# EasyEDA Pro project LisaFPGA Rev 2 EasyEDA Project.epro, board LisaFPGA PCB
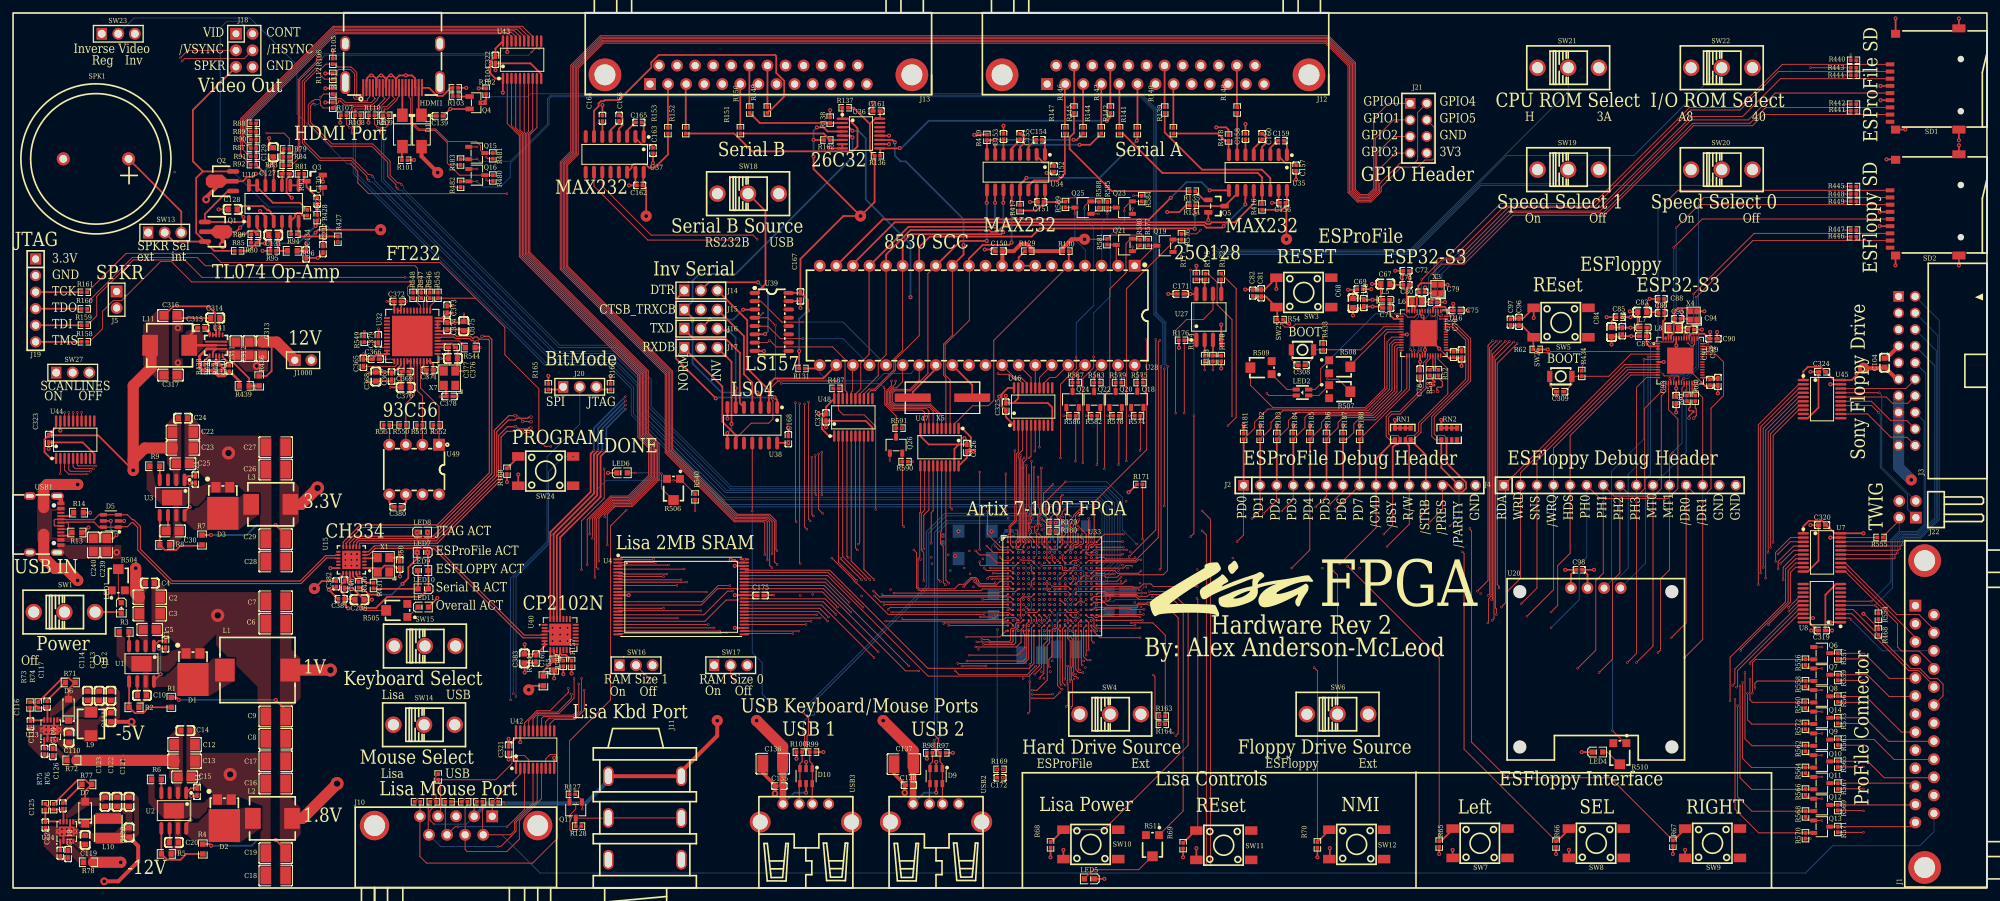
[diagram p11: board, top side]
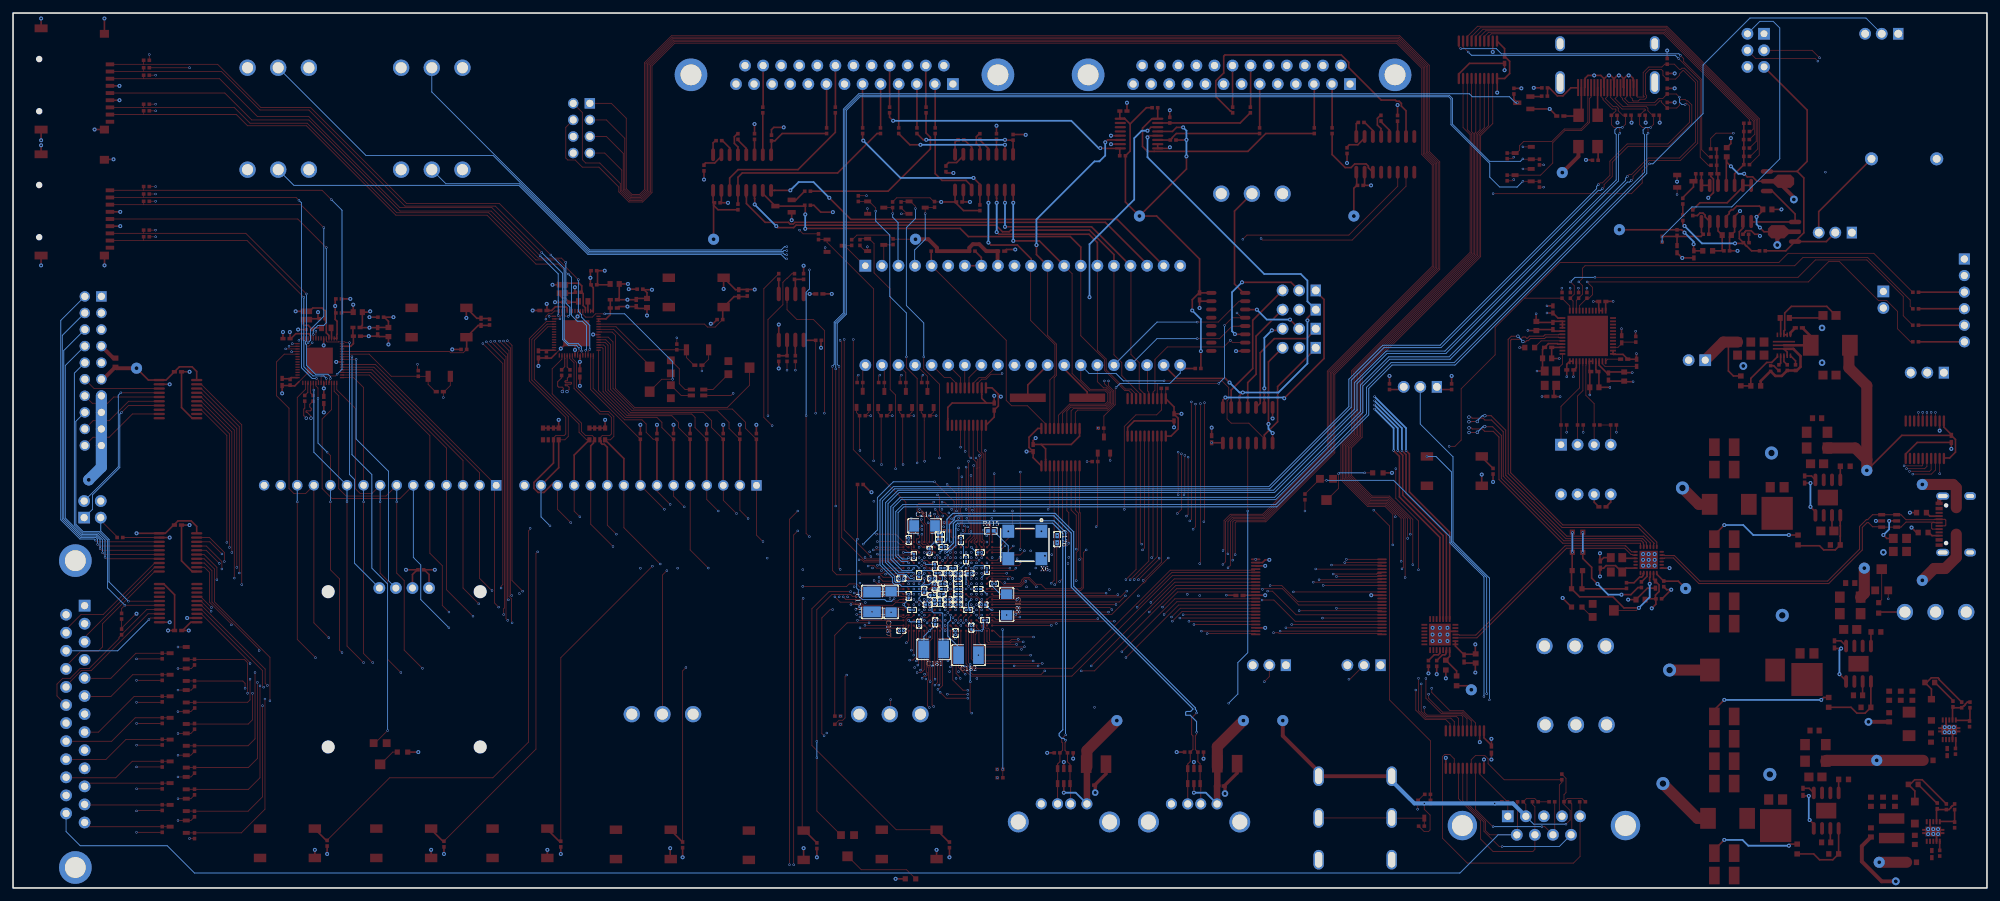
[diagram p12: board, bottom side, seen from below]

Outline 302.51 x 134.11 mm; copper layers: Top Layer, Inner1, Inner2, Inner3, Inner4, Bottom Layer. Coordinates in mm from the lower left corner of the outline.
Outline path: rectangle 0,134.11 302.51,0
Stack: Top Layer 0.035mm Outer layer thickness 1oz / Dielectric1 0.0994mm 3313 RC57% 4.2mil / Inner1 0.0152mm Inner layer thickness / Dielectric2 0.55mm 0.55mm H/H No copper / Inner2 0.0152mm Inner layer thickness / Dielectric3 0.1088mm 2116 RC54% 4.9mil / Inner3 0.0152mm Inner layer thickness / Dielectric4 0.55mm 0.55mm H/H No copper / Inner4 0.0152mm Inner layer thickness / Dielectric5 0.0994mm 3313 RC57% 4.2mil / Bottom Layer 0.035mm Outer layer thickness 1oz

## Design rules (mm)
net USBC_DP: USBC
net USBC_DN: USBC
net KBD_DP: KBD
net KBD_DN: KBD
net MOUSE_DP: MOUSE
net MOUSE_DN: MOUSE
net HDMI_D2_P: HDMI_D2
net HDMI_D2_N: HDMI_D2
net HDMI_D1_P: HDMI_D1
net HDMI_D1_N: HDMI_D1
net HDMI_D0_P: HDMI_D0
net HDMI_D0_N: HDMI_D0
net HDMI_CLK_P: HDMI_CLK
net HDMI_CLK_N: HDMI_CLK
net $3N47776: ESPROFILE_R
net ESPROFILE_DP: ESPROFILE
net $3N47806: ESPROFILE_R
net ESPROFILE_DN: ESPROFILE
net $4N41306: ESFLOPPY_R
net ESFLOPPY_DP: ESFLOPPY
net $4N41307: ESFLOPPY_R
net ESFLOPPY_DN: ESFLOPPY
net JTAG_DP: FT2232
net JTAG_DN: FT2232
net SERIALB_DN: CP2102
net SERIALB_DP: CP2102
template: Custom Config
spacing copperThickness1oz (default): track to track 0.102, other pairs 0.127 to 0.3
spacing copperThickness2oz: track to track 0.203, other pairs 0.152 to 0.3
spacing copperThicknessInner0.5oz: track to track 0.089, other pairs 0.152 to 0.3
track width copperThickness1oz (default): min 0.102, default 0.127, max 2.54
track width copperThickness2oz: min 0.203, default 0.254, max 2.54
track width copperThickness0.5oz: min 0.089, default 0.254, max 2.54
track width MainPower: min 0.508, default 0.508, max 2.54
differential pair differentialPair (default): width min 0.127, default 0.254, max 2.54; gap min 0.152, default 0.152
differential pair USB_Diff: width min 0.158, default 0.158, max 0.158; gap min 0.158, default 0.203
differential pair HDMI_Diff: width min 0.124, default 0.124, max 0.124; gap min 0.203, default 0.203
via viaSize (default): diameter min 0.35, default 0.35, max 10; hole min 0.25, default 0.25, max 6.3
via MainPower: diameter min 1.016, default 1.016, max 10; hole min 0.508, default 0.508, max 6.3
via USB: diameter min 0.35, default 0.35, max 10; hole min 0.25, default 0.25, max 6.3
via HDMI: diameter min 0.35, default 0.35, max 10; hole min 0.25, default 0.25, max 6.3
net USBC_DP uses USB, USB_Diff
net USBC_DN uses USB, USB_Diff
net KBD_DP uses USB, USB_Diff
net KBD_DN uses USB, USB_Diff
net MOUSE_DP uses USB, USB_Diff
net MOUSE_DN uses USB, USB_Diff
net HDMI_D2_P uses HDMI, HDMI_Diff
net HDMI_D2_N uses HDMI, HDMI_Diff
net HDMI_D1_P uses HDMI, HDMI_Diff
net HDMI_D1_N uses HDMI, HDMI_Diff
net HDMI_D0_P uses HDMI, HDMI_Diff
net HDMI_D0_N uses HDMI, HDMI_Diff
net HDMI_CLK_P uses HDMI, HDMI_Diff
net HDMI_CLK_N uses HDMI, HDMI_Diff
net $3N47776 uses USB_Diff
net ESPROFILE_DP uses USB, USB_Diff
net $3N47806 uses USB_Diff
net ESPROFILE_DN uses USB, USB_Diff
net $4N41306 uses USB_Diff
net ESFLOPPY_DP uses USB, USB_Diff
net $4N41307 uses USB_Diff
net ESFLOPPY_DN uses USB, USB_Diff
net JTAG_DP uses USB, USB_Diff
net JTAG_DN uses USB, USB_Diff
net SERIALB_DN uses USB, USB_Diff
net SERIALB_DP uses USB, USB_Diff
diff pair USBC uses USB_Diff
diff pair KBD uses USB_Diff
diff pair MOUSE uses USB_Diff
diff pair HDMI_D2 uses HDMI_Diff
diff pair HDMI_D1 uses HDMI_Diff
diff pair HDMI_D0 uses HDMI_Diff
diff pair HDMI_CLK uses HDMI_Diff
diff pair ESPROFILE_R uses USB_Diff
diff pair ESPROFILE uses USB_Diff
diff pair ESFLOPPY_R uses USB_Diff
diff pair ESFLOPPY uses USB_Diff
diff pair FT2232 uses USB_Diff
diff pair CP2102 uses USB_Diff

## Placement (name value [footprint] x y rotation side)
C1  100nF  [C0402#2]  23.37 37.34 90 top
C2  2.2uF  [C1206]  20.96 44.58 180 top
C3  2.2uF  [C1206]  20.96 42.04 180 top
C4  4.7uF  [C0603]  20.96 46.74 180 top
C5  100nF  [C0805]  20.96 39.62 180 top
C6  47uF  [C1210]  40.26 40.51 0 top
C7  47uF  [C1210]  40.26 43.94 0 top
C8  47uF  [C1210]  40.26 22.86 0 top
C9  47uF  [C1210]  40.26 26.29 0 top
C10  22nF  [C0603]  19.76 29.53 180 top
C11  100nF  [C0402#2]  28.19 14.73 90 top
C12  2.2uF  [C1206]  26.29 21.97 180 top
C13  2.2uF  [C1206]  26.29 19.43 180 top
C14  4.7uF  [C0603]  26.42 24.13 180 top
C15  100nF  [C0805]  26.29 17.02 180 top
C16  47uF  [C1210]  40.26 16 0 top
C17  47uF  [C1210]  40.26 19.43 0 top
C18  47uF  [C1210]  40.26 1.91 0 top
C19  47uF  [C1210]  40.26 5.33 0 top
C20  47nF  [C0603]  24.64 6.98 180 top
C21  100nF  [C0402#2]  27.94 62.61 90 top
C22  2.2uF  [C1206]  26.04 69.85 180 top
C23  2.2uF  [C1206]  26.04 67.44 180 top
C24  4.7uF  [C0603]  26.04 72.01 180 top
C25  100nF  [C0805]  26.04 65.02 180 top
C26  47uF  [C1210]  40.26 64.13 0 top
C27  47uF  [C1210]  40.26 67.56 0 top
C28  47uF  [C1210]  40.26 50.04 0 top
C29  47uF  [C1210]  40.26 53.47 0 top
C30  100nF  [C0805]  24.46 54.73 180 top
C46  100nF  [C0402#2]  50.8 46.5 90 top
C50  100nF  [C0402#2]  59.26 49.57 90 top
C67  10uF  [C0603]  210.31 92.58 180 top
C68  10uF  [C0603]  205.36 89.66 90 top
C69  1uF  [C0402]  206.44 91.79 180 top
C70  100nF  [C0402#2]  207.01 89.66 90 top
C71  100nF  [C0402#2]  210.44 88.9 0 top
C72  1uF  [C0402]  213.49 94.61 0 top
C74  10nF  [C0402]  213.49 92.46 0 top
C75  100nF  [C0402#2]  221.23 88.52 180 top
C76  100nF  [C0402#2]  222 81.79 90 top
C77  1uF  [C0402]  220.77 81.77 90 top
C78  100nF  [C0402#2]  215.65 78.87 90 top
C79  14pF  [C0402]  217.8 89.79 180 top
C80  14pF  [C0402]  215.9 91.31 180 top
C81  100nF  [C0402#2]  191.3 91.16 90 top
C82  1uF  [C0402]  189.99 91.19 270 top
C83  10uF  [C0603]  249.68 88.26 180 top
C84  10uF  [C0603]  244.98 85.22 90 top
C85  1uF  [C0402]  246.17 87.49 180 top
C86  100nF  [C0402#2]  246.63 85.34 90 top
C87  100nF  [C0402#2]  249.81 84.58 0 top
C88  1uF  [C0402]  252.6 90.3 0 top
C89  10nF  [C0402]  252.6 88.14 0 top
C90  100nF  [C0402#2]  260.6 84.2 180 top
C91  1uF  [C0402]  260.06 77.51 90 top
C92  100nF  [C0402#2]  261.28 77.56 90 top
C93  100nF  [C0402#2]  254.89 74.8 90 top
C94  14pF  [C0402]  257.18 85.6 180 top
C95  14pF  [C0402]  255.14 87.25 180 top
C96  100nF  [C0402#2]  230.79 86.77 90 top
C97  1uF  [C0402]  229.49 86.74 270 top
C98  1uF  [C0402]  240.03 48.77 180 top
C104  10uF  [C0603]  286.82 80.52 90 top
C109  100nF  [C0402#2]  6.1 20.83 270 top
C110  10uF  [C0603]  8.57 23.05 90 top
C111  4.7uF  [C0603]  14.99 26.16 270 top
C112  4.7uF  [C0603]  14.99 29.46 90 top
C113  4.7uF  [C0603]  13.21 29.46 90 top
C114  4.7uF  [C0603]  11.43 29.46 90 top
C115  4.7nF  [C0402]  4.83 20.95 270 top
C116  220nF  [C0402]  2.67 25.15 90 top
C117  10pF  [C0402]  5.21 28.19 90 top
C118  100nF  [C0402#2]  8.45 5.19 270 top
C119  10uF  [C0603]  11.05 7.37 90 top
C120  4.7uF  [C0603]  17.78 8.51 270 top
C121  4.7uF  [C0603]  17.78 13.21 90 top
C122  4.7uF  [C0603]  15.93 13.21 90 top
C123  4.7uF  [C0603]  14.1 13.21 90 top
C124  4.7nF  [C0402]  7.24 5.33 270 top
C125  220nF  [C0402]  4.95 9.65 90 top
C126  10pF  [C0402]  7.62 12.57 90 top
C127  100nF  [C0402#2]  41.78 109.47 180 top
C128  10uF  [C0603]  33.66 104.01 180 top
C129  10uF  [C0603]  39.88 112.78 270 top
C130  330nF  [C0402]  46.61 105.28 270 top
C131  10uF  [C0603]  39.88 100.08 0 top
C134  100nF  [C0402#2]  44.92 97.12 90 top
C135  100nF  [C0402#2]  117.45 15.62 0 top
C136  47uF  [C1210]  116.43 19.05 0 top
C137  47uF  [C1210]  136.53 18.98 0 top
C138  100nF  [C0402#2]  137.3 15.76 0 top
C139  100nF  [C0402#2]  65.39 118.33 180 top
C150  100nF  [C0402#2]  151.08 97.62 0 top
C151  1uF  [C0402]  157.51 105.15 180 top
C152  1uF  [C0402]  159.54 110.23 270 top
C153  1uF  [C0402]  151.79 115.19 270 top
C154  1uF  [C0402]  157.26 114.68 180 top
C155  1uF  [C0402]  154.33 115.19 270 top
C156  1uF  [C0402]  194.59 105.03 180 top
C157  1uF  [C0402]  196.63 110.36 270 top
C158  1uF  [C0402]  188.88 115.19 270 top
C159  1uF  [C0402]  194.34 114.55 180 top
C160  1uF  [C0402]  191.42 115.19 270 top
C161  100nF  [C0402#2]  132.34 119.09 180 top
C162  1uF  [C0402]  96.04 107.69 180 top
C163  1uF  [C0402]  98.07 113.03 270 top
C164  1uF  [C0402]  90.33 117.98 270 top
C165  1uF  [C0402]  95.92 117.35 180 top
C166  1uF  [C0402]  92.87 118 270 top
C167  100nF  [C0402#2]  120.67 90.68 270 top
C168  100nF  [C0402#2]  118.82 68.79 90 top
C169  100nF  [C0402#2]  80.14 35.18 90 top
C171  100nF  [C0402#2]  178.94 91.06 0 top
C172  1uF  [C0402]  151.26 16.89 180 top
C175  100nF  [C0402#2]  114.55 44.83 180 top
C176  100nF  [C0402#2]  142.49 53.47 90 bottom
C177  330uF  [C1210]  170.87 43.84 90 bottom
C181  47uF  [C1210]  161.42 36.58 0 bottom
C182  47uF  [C1210]  156.08 35.69 180 bottom
C187  100uF  [C1206]  167.94 43.84 90 bottom
C188  100uF  [C1206]  150.24 43.43 90 bottom
C214  100uF  [C1206]  162.81 55.5 180 bottom
C237  100nF  [C0402#2]  47.5 97.92 90 top
C238  10uF  [C0603]  53.09 44.2 180 top
C239  100nF  [C0805]  14.35 52.58 270 top
C240  100nF  [C0805]  12.32 52.58 90 top
C259  470nF  [C0201]  160.02 49.02 180 bottom
C260  470nF  [C0201]  160.78 48.26 180 bottom
C261  470nF  [C0201]  157.25 53.31 270 bottom
C262  470nF  [C0201]  154.33 51.43 180 bottom
C263  470nF  [C0201]  156.46 50.37 90 bottom
C264  470nF  [C0201]  153.26 48.74 90 bottom
C265  470nF  [C0201]  154.56 45.82 0 bottom
C266  470nF  [C0201]  153.8 43.43 0 bottom
C267  470nF  [C0201]  156.13 42.62 0 bottom
C268  470nF  [C0201]  153.54 41.05 180 bottom
C269  470nF  [C0201]  159.94 52.25 180 bottom
C270  470nF  [C0201]  160.45 53.42 180 bottom
C271  470nF  [C0201]  165.25 53.34 270 bottom
C272  470nF  [C0201]  162.05 51.69 270 bottom
C273  470nF  [C0201]  164.46 50.9 270 bottom
C274  470nF  [C0201]  163.65 47.95 90 bottom
C275  470nF  [C0201]  166.37 39.42 180 bottom
C276  470nF  [C0201]  163.65 40.51 270 bottom
C277  470nF  [C0201]  161.19 40.72 90 bottom
C278  470nF  [C0201]  164.74 42.62 180 bottom
C279  470nF  [C0201]  161.26 43.81 90 bottom
C280  470nF  [C0201]  161.65 47.45 180 bottom
C281  470nF  [C0201]  161.24 49.33 270 bottom
C282  470nF  [C0201]  161.26 46.23 270 bottom
C283  470nF  [C0201]  159.26 43.43 180 bottom
C284  470nF  [C0201]  157.66 44.22 0 bottom
C285  470nF  [C0201]  157.66 45.03 180 bottom
C286  470nF  [C0201]  157.66 45.82 0 bottom
C287  470nF  [C0201]  160.05 46.63 0 bottom
C288  470nF  [C0201]  157.66 48.21 180 bottom
C289  470nF  [C0201]  158.47 49.02 180 bottom
C290  470nF  [C0201]  159.26 48.23 180 bottom
C291  4.7uF  [C0201]  152.17 46.63 0 bottom
C292  4.7uF  [C0201]  155.93 48.23 180 bottom
C293  4.7uF  [C0201]  158.06 39.09 90 bottom
C294  4.7uF  [C0201]  155.65 39.9 90 bottom
C295  4.7uF  [C0201]  160.45 54.2 180 bottom
C296  4.7uF  [C0201]  162.86 45.54 90 bottom
C297  4.7uF  [C0201]  166.37 47.42 180 bottom
C298  4.7uF  [C0201]  165.25 44.75 90 bottom
C299  4.7uF  [C0201]  162.36 43.43 180 bottom
C300  4.7uF  [C0201]  159.94 45.82 0 bottom
C301  4.7uF  [C0201]  161.65 44.91 0 bottom
C302  4.7uF  [C0201]  157.66 43.43 180 bottom
C303  4.7uF  [C0201]  160.45 43.81 270 bottom
C304  4.7uF  [C0201]  159.26 44.22 0 bottom
C305  4.7uF  [C0201]  160.2 45.03 0 bottom
C306  4.7uF  [C0201]  157.68 46.61 180 bottom
C307  4.7uF  [C0201]  157.71 47.4 0 bottom
C308  100nF  [C0402#2]  197.48 80.14 180 top
C309  100nF  [C0402#2]  237.11 76.07 180 top
C310  1.2nF  [C0402#3]  33.15 79.63 90 top
C311  22uF  [C0805]  34.16 82.68 90 top
C312  22uF  [C0805]  36.2 82.68 90 top
C313  22uF  [C0805]  38.23 82.68 90 top
C314  4.7uF  [C0603]  30.99 87.38 0 top
C315  100nF  [C0402#2]  28.83 85.85 180 top
C316  22uF  [C0805]  24.13 87.76 180 top
C317  22uF  [C0805]  24.13 78.61 180 top
C319  100nF  [C0402#2]  277.21 39.46 180 top
C320  100nF  [C0402#2]  277.24 55.63 0 top
C321  100nF  [C0402#2]  75.95 21.21 90 top
C322  100nF  [C0402#2]  73.93 126.95 90 top
C323  100nF  [C0402#2]  5.46 68.83 90 top
C324  100nF  [C0402#2]  277.24 79.12 0 top
C325  100nF  [C0402#2]  152.15 73.79 90 top
C326  100nF  [C0402#2]  146.18 67.44 270 top
C327  100nF  [C0402#2]  124.59 72.14 90 top
C365  100nF  [C0402#2]  53.69 80.5 90 top
C366  100nF  [C0402#2]  55.6 81.06 180 top
C367  100nF  [C0402#2]  58.01 78.39 90 top
C368  4.7uF  [C0603]  55.6 78.39 90 top
C369  100nF  [C0402#2]  60.17 79.15 180 top
C370  4.7uF  [C0603]  60.17 76.74 180 top
C371  100nF  [C0402#2]  63.85 79.41 180 top
C372  100nF  [C0402#2]  58.95 89.9 180 top
C373  100nF  [C0402#2]  66.52 88.68 270 top
C374  100nF  [C0402#2]  66.52 86.14 270 top
C375  4.7uF  [C0603]  69.06 86.14 270 top
C376  100nF  [C0402#2]  67.25 82.86 180 top
C377  4.7uF  [C0603]  67.41 81.19 180 top
C378  100nF  [C0402#2]  66.9 75.34 0 top
C379  100nF  [C0402#2]  55.98 84.11 270 top
C380  100nF  [C0402#2]  58.93 58.42 0 top
C381  1uF  [C0402]  50.29 44.32 0 top
C382  1uF  [C0402]  49.53 46.61 90 top
C383  4.7uF  [C0603]  78.36 35.18 270 top
D1  SS10P6-M3/86A  [TO-277A_L6.1-W4.6-P2.13-LS6.5-TR]  27.58 33.96 90 top
D2  SS10P6-M3/86A  [TO-277A_L6.1-W4.6-P2.13-LS6.5-TR]  32.38 11.56 90 top
D3  SS10P6-M3/86A  [TO-277A_L6.1-W4.6-P2.13-LS6.5-TR]  32.15 59.42 90 top
D5  USBLC6-2SC6  [SOT-23-6_L2.9-W1.6-P0.95-LS2.8-BL]  14.99 56.26 90 top
D6  SL02-GS08  [SOD-123_L2.7-W1.8-LS3.7-RD]  8.51 27.31 90 top
D7  SL03-GS08  [SMF_L2.8-W1.8-LS3.7-RD]  11.05 11.56 90 top
D8  SS14  [SMA_L4.3-W2.6-LS5.0-RD]  59.67 116.04 270 top
D9  USBLC6-2SC6  [SOT-23-6_L2.9-W1.6-P0.95-LS2.8-BL]  141.48 17.14 180 top
D10  USBLC6-2SC6  [SOT-23-6_L2.9-W1.6-P0.95-LS2.8-BL]  121.54 17.14 180 top
D11  SS14  [SMA_L4.3-W2.6-LS5.0-RD]  62.6 116.04 270 top
HDMI1  HDMI-001S  [HDMI-SMD_HDMI-001S]  58.16 126.05 180 top
J1  D-SUB-DR-25PCM-BB  [DB25-TH_D-SUB-DR-25PCM-BB]  292.97 26.66 90 top
J2  ZX-PZ2.54-1-15PZZ  [HDR-TH_15P-P2.54-V-M]  206.36 61.71 0 top
J3  X9555WR-2x10-6TV01  [CONN-TH_20P-P2.54_XKB_X9555WR-2X10-6TV01]  290.25 79.25 90 top
J4  ZX-PZ2.54-1-15PZZ  [HDR-TH_15P-P2.54-V-M]  246.25 61.72 0 top
J5  HX PZ2.54-1x2P ZZ  [HDR-TH_2P-P2.54-V-M-3]  15.88 90.17 270 top
J10  D-SUB-DR-9PCM-CB  [DB9-TH_D-SUB-DR-9PCM-CB]  67.9 9.57 0 top
J11  PJ-611E  [AUDIO-TH_PJ-611E]  96.82 10.73 270 top
J12  D-SUB-DR-25PCM-BB  [DB25-TH_D-SUB-DR-25PCM-BB]  175.1 124.64 180 top
J13  D-SUB-DR-25PCM-BB  [DB25-TH_D-SUB-DR-25PCM-BB]  114.23 124.64 180 top
J14  XDZ254-1-03-Z-2.5-G1  [HDR-TH_3P-P2.54-V-M-1]  105.41 91.59 0 top
J15  XDZ254-1-03-Z-2.5-G1  [HDR-TH_3P-P2.54-V-M-1]  105.41 88.65 0 top
J16  XDZ254-1-03-Z-2.5-G1  [HDR-TH_3P-P2.54-V-M-1]  105.41 85.72 0 top
J17  XDZ254-1-03-Z-2.5-G1  [HDR-TH_3P-P2.54-V-M-1]  105.41 82.8 0 top
J18  PH2.54-2X3P-H25  [HDR-TH_6P-P2.54-V-M-R2-C3-S2.54-1]  35.43 128.4 270 top
J19  PZ2.54-1X6P-H25  [HDR-TH_6P-P2.54-V-M]  3.46 90.06 270 top
J20  XDZ254-1-03-Z-2.5-G1  [HDR-TH_3P-P2.54-V-M-1]  86.85 76.81 0 top
J21  2.54-2*4  [HDR-TH_8P-P2.54-V-F-R2-C4-S2.54]  215.39 116.46 270 top
J22  PZ254R-12-4P  [HDR-TH_4P-P2.54-H-M-R2-C2-S2.54]  290.35 58.04 90 top
J1000  HX PZ2.54-1x2P ZZ  [HDR-TH_2P-P2.54-V-M-3]  44.45 80.9 0 top
L1  800nH  [IND-SMD_L11.5-W10.0_FXL1040]  37.47 33.4 0 top
L2  1uH  [IND-SMD_L7.0-W6.6]  39.75 10.67 0 top
L3  1uH  [IND-SMD_L7.0-W6.6]  39.5 58.8 0 top
L5  2nH  [L0402-RD]  210.44 90.17 0 top
L6  24nH  [IND-SMD_L1.6-W0.8]  215.14 89.92 0 top
L7  2nH  [L0402-RD]  249.88 85.91 0 top
L8  24nH  [IND-SMD_L1.6-W0.8]  254.51 85.85 0 top
L9  4.7uH  [IND-SMD_L4.5-W4.2]  11.94 25.15 90 top
L10  10uH  [IND-SMD_L4.0-W4.0_FNR40XXS]  14.61 9.14 90 top
L11  1uH  [IND-SMD_L7.0-W6.6]  24 83.18 0 top
LED1  XL-1608SURC-06  [LED0603-RD_RED]  16.59 42.93 270 top
LED2  TJ-S1615CY6TGLCCSRGB-A5  [LED-ARRAY-SMD_4P-L1.6-W1.5-BL-FD]  197.61 75.95 0 top
LED4  XL-1608UGC-04  [LED0603-RD_GREEN]  242.82 20.83 0 top
LED5  XL-1608UGC-04  [LED0603-RD_GREEN]  164.97 1.4 180 top
LED6  XL-1608UGC-04  [LED0603-RD_GREEN]  93.34 63.63 0 top
LED7  XL-1608UGC-04  [LED0603-RD_GREEN]  62.74 51.45 180 top
LED8  XL-1608UGC-04  [LED0603-RD_GREEN]  62.74 54.54 0 top
LED9  XL-1608UGC-04  [LED0603-RD_GREEN]  62.77 48.64 0 top
LED10  XL-1608UGC-04  [LED0603-RD_GREEN]  62.87 45.86 180 top
LED11  XL-1608UGC-04  [LED0603-RD_GREEN]  62.87 43.05 0 top
Q1  ZXTN2010ZTA  [SOT-89-3_L4.5-W2.5-P1.50-LS4.2-TR]  30.23 100.58 90 top
Q2  ZXTP2012ZTA  [SOT-89-3_L4.5-W2.5-P1.50-LS4.2-TR]  32.89 108.33 270 top
Q3  2N3904S-RTK/PS  [SOT-23-3_L2.9-W1.3-P1.90-LS2.4-TR]  46.23 108.33 0 top
Q4  2N7002-HXY  [SOT-23-3_L2.9-W1.3-P1.90-LS2.4-BR]  70.98 120.36 180 top
Q5  2N3904S-RTK/PS  [SOT-23-3_L2.9-W1.3-P1.90-LS2.4-TR]  184.43 104.52 180 top
Q6  BSS138LT1G  [SOT-23-3_L2.9-W1.6-P1.90-LS2.8-BR]  277.2 35.98 180 top
Q7  BSS138LT1G  [SOT-23-3_L2.9-W1.6-P1.90-LS2.8-BR]  277.2 32.68 180 top
Q8  BSS138LT1G  [SOT-23-3_L2.9-W1.6-P1.90-LS2.8-BR]  277.2 29.38 180 top
Q9  BSS138LT1G  [SOT-23-3_L2.9-W1.6-P1.90-LS2.8-BR]  277.2 22.74 180 top
Q10  BSS138LT1G  [SOT-23-3_L2.9-W1.6-P1.90-LS2.8-BR]  277.2 19.4 180 top
Q11  BSS138LT1G  [SOT-23-3_L2.9-W1.6-P1.90-LS2.8-BR]  277.21 16.07 180 top
Q12  BSS138LT1G  [SOT-23-3_L2.9-W1.6-P1.90-LS2.8-BR]  277.2 12.73 180 top
Q13  BSS138LT1G  [SOT-23-3_L2.9-W1.6-P1.90-LS2.8-BR]  277.2 9.39 180 top
Q14  BSS138LT1G  [SOT-23-3_L2.9-W1.6-P1.90-LS2.8-BR]  277.2 26.08 180 top
Q15  BSS138LT1G  [SOT-23-3_L2.9-W1.6-P1.90-LS2.8-BR]  71.07 112.65 180 top
Q16  BSS138LT1G  [SOT-23-3_L2.9-W1.6-P1.90-LS2.8-BR]  71.09 109.26 180 top
Q17  BSS138LT1G  [SOT-23-3_L2.9-W1.6-P1.90-LS2.8-BR]  86.23 11.94 90 top
Q18  BSS138LT1G  [SOT-23-3_L2.9-W1.6-P1.90-LS2.8-BR]  172.3 74.9 270 top
Q19  BSS138LT1G  [SOT-23-3_L2.9-W1.6-P1.90-LS2.8-BR]  176.53 98.45 0 top
Q20  BSS138LT1G  [SOT-23-3_L2.9-W1.6-P1.90-LS2.8-BR]  168.98 74.87 270 top
Q21  BSS138LT1G  [SOT-23-3_L2.9-W1.6-P1.90-LS2.8-BR]  170.31 98.57 0 top
Q22  BSS138LT1G  [SOT-23-3_L2.9-W1.6-P1.90-LS2.8-BR]  165.68 74.88 270 top
Q23  BSS138LT1G  [SOT-23-3_L2.9-W1.6-P1.90-LS2.8-BR]  170.31 104.29 0 top
Q24  BSS138LT1G  [SOT-23-3_L2.9-W1.6-P1.90-LS2.8-BR]  162.38 74.88 270 top
Q25  BSS138LT1G  [SOT-23-3_L2.9-W1.6-P1.90-LS2.8-BR]  163.96 104.29 0 top
Q26  BSS138LT1G  [SOT-23-3_L2.9-W1.6-P1.90-LS2.8-BR]  135.33 67.89 270 top
R1  100kΩ  [R0603]  24.26 28.45 90 top
R2  300kΩ  [R0603]  18.54 27.69 180 top
R3  30kΩ  [R0603]  17.02 39.24 180 top
R4  100kΩ  [R0603]  29.08 5.97 90 top
R5  71.5kΩ  [R0603]  23.49 5.22 180 top
R6  30kΩ  [R0603]  21.97 16.64 180 top
R7  100kΩ  [R0603]  28.96 53.34 90 top
R8  29.4kΩ  [R0603]  23.24 52.58 180 top
R9  30kΩ  [R0603]  21.72 64.64 180 top
R13  5.1kΩ  [R0603]  9.78 54.48 0 top
R14  5.1kΩ  [R0603]  10.03 57.53 0 top
R52  22Ω  [R0402]  218.44 78.99 90 top
R53  22Ω  [R0402]  217.16 78.99 90 top
R54  10kΩ  [R0402]  194.18 87.12 0 top
R60  22Ω  [R0402]  257.81 75.06 90 top
R61  22Ω  [R0402]  256.54 75.06 90 top
R62  10kΩ  [R0402]  233.43 82.55 180 top
R65  1kΩ  [R0402]  218.57 6.73 270 top
R66  1kΩ  [R0402]  236.47 6.73 270 top
R67  1kΩ  [R0402]  254.38 6.86 270 top
R68  1kΩ  [R0402]  159 6.6 270 top
R69  1kΩ  [R0402]  179.32 6.48 270 top
R70  1kΩ  [R0402]  199.9 6.6 270 top
R71  100kΩ  [R0603]  8.76 31.5 0 top
R72  10Ω  [R0603]  9.02 19.56 0 top
R73  150kΩ  [R0402]  2.6 28.06 90 top
R74  619kΩ  [R0402]  3.87 28.06 90 top
R75  121kΩ  [R0402]  4.95 12.45 90 top
R76  1.2MΩ  [R0402]  6.22 12.45 90 top
R77  100kΩ  [R0603]  11.3 15.88 0 top
R78  10Ω  [R0603]  11.56 3.94 0 top
R79  10kΩ  [R0402]  41.91 113.28 180 top
R80  10kΩ  [R0402]  34.42 97.66 180 top
R81  1kΩ  [R0402]  44.2 109.47 180 top
R82  20kΩ  [R0402]  46.61 102.74 90 top
R83  39kΩ  [R0402]  41.86 110.78 0 top
R84  20kΩ  [R0402]  41.86 112.06 0 top
R85  20kΩ  [R0402]  36.89 98.91 180 top
R86  680Ω  [R0402]  36.96 100.2 180 top
R87  82kΩ  [R0402]  36.83 113.41 0 top
R88  10kΩ  [R0402]  36.83 117.22 0 top
R89  20kΩ  [R0402]  36.83 115.95 180 top
R90  39kΩ  [R0402]  36.85 114.72 180 top
R91  160kΩ  [R0402]  36.83 112.14 0 top
R92  316kΩ  [R0402]  36.83 110.87 0 top
R93  10kΩ  [R0402]  45.09 103.5 270 top
R94  10kΩ  [R0402]  43.05 100.2 0 top
R95  10kΩ  [R0402]  39.88 97.66 180 top
R96  5.1kΩ  [R0603]  42.8 97.66 180 top
R97  15kΩ  [R0402]  142.51 20.71 0 top
R98  15kΩ  [R0402]  140.48 20.71 180 top
R99  15kΩ  [R0402]  122.53 20.83 0 top
R100  15kΩ  [R0402]  120.5 20.83 180 top
R101  27kΩ  [R0402]  60.03 111.55 180 top
R102  10kΩ  [R0402]  67.78 122.65 0 top
R103  10kΩ  [R0402]  67.8 121.38 0 top
R104  4.7kΩ  [R0402]  72.5 122.14 90 top
R105  49.9Ω  [R0402]  49.01 126.71 90 top
R106  49.9Ω  [R0402]  49.01 124.42 90 top
R107  49.9Ω  [R0402]  50.66 118.45 180 top
R108  49.9Ω  [R0402]  52.82 118.45 180 top
R109  49.9Ω  [R0402]  57.13 118.44 180 top
R110  49.9Ω  [R0402]  54.98 118.45 180 top
R111  49.9Ω  [R0402]  49.01 119.98 90 top
R112  49.9Ω  [R0402]  49.01 122.14 90 top
R127  3.3kΩ  [R0402]  85.73 14.35 180 top
R128  3.3kΩ  [R0402]  86.67 9.47 0 top
R129  3.3kΩ  [R0402]  155.52 97.62 180 top
R130  3.3kΩ  [R0402]  161.37 97.62 180 top
R131  3.3kΩ  [R0402]  120.9 79.63 180 top
R134  10kΩ  [R0402]  180.75 104.65 0 top
R135  10kΩ  [R0402]  180.75 106.81 180 top
R136  10kΩ  [R0402]  132.47 112.23 180 top
R137  10kΩ  [R0402]  127.52 119.6 180 top
R138  10kΩ  [R0402]  125.23 117.69 270 top
R139  50Ω  [R0402]  177.83 116.08 90 top
R140  50Ω  [R0402]  176.5 119.25 90 top
R141  50Ω  [R0402]  172.31 116.08 90 top
R142  50Ω  [R0402]  169.57 116.08 90 top
R143  50Ω  [R0402]  168.18 119.25 90 top
R144  50Ω  [R0402]  166.78 116.08 90 top
R145  50Ω  [R0402]  163.99 116.08 90 top
R146  50Ω  [R0402]  162.59 119.25 90 top
R147  50Ω  [R0402]  161.19 116.08 90 top
R148  50Ω  [R0402]  187.61 119.25 90 top
R149  50Ω  [R0402]  115.6 119.25 90 top
R150  50Ω  [R0402]  112.89 119.25 90 top
R151  50Ω  [R0402]  111.47 116.08 90 top
R152  50Ω  [R0402]  103.09 116.08 90 top
R153  50Ω  [R0402]  100.36 116.08 90 top
R154  22.1kΩ  [R0603]  81.28 31.75 90 top
R155  47.5kΩ  [R0603]  82.93 34.16 90 top
R157  10kΩ  [R0402]  85.6 34.42 90 top
R158  100Ω  [R0402]  10.93 83.72 0 top
R159  100Ω  [R0402]  10.93 86.26 0 top
R160  100Ω  [R0402]  10.92 88.77 0 top
R161  100Ω  [R0402]  10.92 91.31 0 top
R162  10kΩ  [R0402]  124.72 114.65 180 top
R163  1kΩ  [R0402]  176.13 26.34 0 top
R164  1kΩ  [R0402]  176.13 25.09 0 top
R165  1kΩ  [R0402]  82.04 76.83 90 top
R166  1kΩ  [R0402]  91.57 76.83 90 top
R168  4.7kΩ  [R0402]  75.69 63.88 270 top
R169  4.7kΩ  [R0402]  151.26 18.18 0 top
R171  1kΩ  [R0402]  172.66 61.85 0 top
R172  100Ω  [R0402]  185.17 93.73 90 top
R173  100Ω  [R0402]  183.9 81.15 90 top
R174  100Ω  [R0402]  182.63 81.15 90 top
R175  100Ω  [R0402]  182.75 93.73 90 top
R176  4.7kΩ  [R0402]  179.07 83.95 180 top
R177  1.8kΩ  [R0402]  181.36 93.73 90 top
R178  1.8kΩ  [R0402]  185.17 81.15 90 top
R179  100Ω  [R0402]  159.38 56.01 180 top
R180  100Ω  [R0402]  159.38 54.74 180 top
R181  10kΩ  [R0402]  188.59 69.21 270 top
R182  10kΩ  [R0402]  191.13 69.21 270 top
R183  10kΩ  [R0402]  193.67 69.21 270 top
R184  10kΩ  [R0402]  196.21 69.21 270 top
R185  10kΩ  [R0402]  198.75 69.21 270 top
R186  10kΩ  [R0402]  201.29 69.21 270 top
R187  10kΩ  [R0402]  203.83 69.21 270 top
R188  10kΩ  [R0402]  206.38 69.21 270 top
R415  33Ω  [R0402]  152.65 54.74 180 bottom
R416  10kΩ  [R0402]  191.42 104.39 270 top
R417  10kΩ  [R0402]  154.33 104.27 270 top
R418  10kΩ  [R0402]  186.28 114.96 90 top
R419  10kΩ  [R0402]  149.25 115.06 90 top
R427  100Ω  [R0402]  49.78 99.44 270 top
R428  1kΩ  [R0402]  47.5 100.46 90 top
R430  200Ω  [R0402]  52.96 46.48 90 top
R431  200Ω  [R0402]  55.25 46.35 90 top
R433  10kΩ  [R0402]  200.79 82.93 90 top
R434  10kΩ  [R0402]  240.41 78.87 90 top
R435  28.7kΩ  [R0402]  31.88 79.76 90 top
R436  732kΩ  [R0603]  37.72 77.72 90 top
R437  86.6kΩ  [R0402]  30.61 79.76 90 top
R438  169kΩ  [R0402]  29.34 79.76 270 top
R439  80.6kΩ  [R0603]  35.43 76.96 0 top
R440  39kΩ  [R0402]  282.07 126.87 0 top
R441  39kΩ  [R0402]  282.07 119.13 0 top
R442  39kΩ  [R0402]  282.07 120.14 0 top
R443  39kΩ  [R0402]  282.07 125.73 180 top
R444  39kΩ  [R0402]  282.07 124.59 180 top
R445  39kΩ  [R0402]  282.07 107.52 0 top
R446  39kΩ  [R0402]  282.07 99.82 0 top
R447  39kΩ  [R0402]  282.07 100.84 0 top
R448  39kΩ  [R0402]  282.07 106.38 180 top
R449  39kΩ  [R0402]  282.07 105.26 180 top
R468  3.3kΩ  [R0402]  285.88 39.24 270 top
R469  3.3kΩ  [R0402]  73.91 13.21 180 top
R470  3.3kΩ  [R0402]  66.67 13.21 180 top
R471  3.3kΩ  [R0402]  65.15 17.02 270 top
R472  3.3kΩ  [R0402]  71.5 13.21 0 top
R473  3.3kΩ  [R0402]  64.39 13.21 180 top
R474  3.3kΩ  [R0402]  69.22 13.21 0 top
R475  3.3kΩ  [R0402]  61.98 13.21 0 top
R480  1.5kΩ  [R0402]  73.53 108.83 90 top
R481  1.5kΩ  [R0402]  73.53 112.22 90 top
R482  1.5kΩ  [R0402]  68.59 107.86 270 top
R483  1.5kΩ  [R0402]  68.58 111.27 270 top
R487  3.3kΩ  [R0402]  126.11 76.58 0 top
R504  10kΩ  [RES-ADJ-SMD_3P-L3.0-W3.8-P1.75-BR]  16.13 47.24 270 top
R505  10kΩ  [RES-ADJ-SMD_3P-L3.0-W3.8-P1.75-BR]  58.8 42.54 0 top
R506  10kΩ  [RES-ADJ-SMD_3P-L3.0-W3.8-P1.75-BR]  101.22 61.09 90 top
R507  10kΩ  [RES-ADJ-SMD_3P-L3.0-W3.8-P1.75-BR]  203.33 76.07 180 top
R508  10kΩ  [RES-ADJ-SMD_3P-L3.0-W3.8-P1.75-BR]  203.33 79.88 180 top
R509  10kΩ  [RES-ADJ-SMD_3P-L3.0-W3.8-P1.75-BR]  191.26 79.76 0 top
R510  10kΩ  [RES-ADJ-SMD_3P-L3.0-W3.8-P1.75-BR]  246.25 20.57 90 top
R511  10kΩ  [RES-ADJ-SMD_3P-L3.0-W3.8-P1.75-BR]  174.62 6.48 90 top
R540  200Ω  [R0402]  104.52 59.94 270 top
R544  12kΩ  [R0603]  70.07 82.84 0 top
R545  4.7kΩ  [R0402]  65.12 90.84 90 top
R546  4.7kΩ  [R0402]  63.85 90.84 90 top
R547  4.7kΩ  [R0402]  62.58 90.84 90 top
R548  4.7kΩ  [R0402]  61.31 90.84 90 top
R549  10kΩ  [R0402]  53.82 84.11 90 top
R550  2.2kΩ  [R0402]  59.77 70.97 180 top
R551  10kΩ  [R0402]  57.23 70.97 180 top
R552  10kΩ  [R0402]  64.85 70.97 180 top
R553  10kΩ  [R0402]  62.31 70.97 180 top
R554  3.3kΩ  [R0402]  285.88 41.66 270 top
R555  1kΩ  [R0402]  286.13 53.72 0 top
R556  10kΩ  [R0402]  274.7 34.62 270 top
R557  10kΩ  [R0402]  279.65 35.56 90 top
R558  10kΩ  [R0402]  274.7 31.32 270 top
R559  10kΩ  [R0402]  279.65 32.26 90 top
R560  10kΩ  [R0402]  274.68 28.02 270 top
R561  10kΩ  [R0402]  279.65 28.96 90 top
R562  10kΩ  [R0402]  274.7 21.39 270 top
R563  10kΩ  [R0402]  279.65 22.35 90 top
R564  10kΩ  [R0402]  274.7 18.03 270 top
R565  10kΩ  [R0402]  279.65 18.97 90 top
R566  10kΩ  [R0402]  274.7 14.71 270 top
R567  10kΩ  [R0402]  279.65 15.62 90 top
R568  10kΩ  [R0402]  274.71 11.34 270 top
R569  10kΩ  [R0402]  279.65 12.32 90 top
R570  10kΩ  [R0402]  274.7 8 270 top
R571  10kΩ  [R0402]  279.65 8.97 90 top
R572  10kΩ  [R0402]  274.7 24.76 270 top
R573  10kΩ  [R0402]  279.65 25.65 90 top
R574  10kΩ  [R0402]  172.34 72.39 180 top
R575  10kΩ  [R0402]  172.72 77.47 180 top
R576  10kΩ  [R0402]  179.07 99.82 90 top
R577  10kΩ  [R0402]  173.99 98.93 270 top
R578  10kΩ  [R0402]  169.04 72.39 180 top
R579  10kΩ  [R0402]  169.42 77.47 180 top
R580  10kΩ  [R0402]  172.72 98.93 270 top
R581  10kΩ  [R0402]  167.64 99.06 270 top
R582  10kΩ  [R0402]  165.73 72.39 180 top
R583  10kΩ  [R0402]  166.12 77.47 180 top
R584  10kΩ  [R0402]  172.97 105.66 90 top
R585  10kΩ  [R0402]  167.72 104.72 270 top
R586  10kΩ  [R0402]  162.43 72.39 180 top
R587  10kΩ  [R0402]  162.81 77.47 180 top
R588  10kΩ  [R0402]  166.42 104.72 270 top
R589  10kΩ  [R0402]  161.29 104.77 270 top
R590  10kΩ  [R0402]  136.7 65.35 0 top
R591  10kΩ  [R0402]  135.79 70.48 180 top
R592  1kΩ  [R0402]  84.33 34.42 90 top
RN1  47kΩ  [RES-ARRAY-SMD_0603-8P-L3.2-W1.6-BL]  212.98 69.6 0 top
RN2  47kΩ  [RES-ARRAY-SMD_0603-8P-L3.2-W1.6-BL]  220.09 69.6 0 top
SD1  TF-01A  [TF-SMD_TF-01A]  292.94 124.01 90 top
SD2  TF-01A  [TF-SMD_TF-01A]  292.94 104.7 90 top
SPK1  2308BOX-8Ω1W-P10MM  [BUZ-TH_BD23.0-P10.0-D0.0.8-FD]  12.7 111.76 180 top
SW1  SS-12D10L4  [SW-TH_SS-12D10L3]  7.87 42.29 0 top
SW3  TS-1002S-05026C  [KEY-SMD_4P-L6.0-W6.0-P4.50-LS9.0]  197.81 91.28 0 top
SW4  SS-12D10L4  [SW-TH_SS-12D10L3]  168.15 26.64 0 top
SW5  TS-1002S-05026C  [KEY-SMD_4P-L6.0-W6.0-P4.50-LS9.0]  237.23 86.67 0 top
SW6  SS-12D10L4  [SW-TH_SS-12D10L3]  202.99 26.64 0 top
SW7  TS-1002S-05026C  [KEY-SMD_4P-L6.0-W6.0-P4.50-LS9.0]  224.83 6.85 0 top
SW8  TS-1002S-05026C  [KEY-SMD_4P-L6.0-W6.0-P4.50-LS9.0]  242.64 6.85 0 top
SW9  TS-1002S-05026C  [KEY-SMD_4P-L6.0-W6.0-P4.50-LS9.0]  260.46 6.85 0 top
SW10  TS-1002S-05026C  [KEY-SMD_4P-L6.0-W6.0-P4.50-LS9.0]  165.18 6.67 0 top
SW11  TS-1002S-05026C  [KEY-SMD_4P-L6.0-W6.0-P4.50-LS9.0]  185.55 6.55 0 top
SW12  TS-1002S-05026C  [KEY-SMD_4P-L6.0-W6.0-P4.50-LS9.0]  205.92 6.67 0 top
SW13  XDZ254-1-03-Z-2.5-G1  [HDR-TH_3P-P2.54-V-M-1]  23.24 100.46 0 top
SW14  SS-12D10L4  [SW-TH_SS-12D10L3]  62.99 25.02 0 top
SW15  SS-12D10L4  [SW-TH_SS-12D10L3]  63.12 37.08 0 top
SW16  XDZ254-1-03-Z-2.5-G1  [HDR-TH_3P-P2.54-V-M-1]  95.48 34.14 0 top
SW17  XDZ254-1-03-Z-2.5-G1  [HDR-TH_3P-P2.54-V-M-1]  109.98 34.14 0 top
SW18  SS-12D10L4  [SW-TH_SS-12D10L3]  112.65 106.43 0 top
SW19  SS-12D10L4  [SW-TH_SS-12D10L3]  238.34 110.11 0 top
SW20  SS-12D10L4  [SW-TH_SS-12D10L3]  261.87 110.11 0 top
SW21  SS-12D10L4  [SW-TH_SS-12D10L3]  238.34 125.73 0 top
SW22  SS-12D10L4  [SW-TH_SS-12D10L3]  261.87 125.73 0 top
SW23  XDZ254-1-03-Z-2.5-G1  [HDR-TH_3P-P2.54-V-M-1]  16.13 130.94 0 top
SW24  TS-1002S-05026C  [KEY-SMD_4P-L6.0-W6.0-P4.50-LS9.0]  81.63 63.9 0 top
SW25  B3U-1000P  [KEY-SMD_B3U-1000PM]  197.61 82.49 0 top
SW26  B3U-1000P  [KEY-SMD_B3U-1000PM]  237.2 78.43 0 top
SW27  XDZ254-1-03-Z-2.5-G1  [HDR-TH_3P-P2.54-V-M-1]  9.14 78.99 0 top
U1  LMR14050SDDAR  [SOIC-8_L4.9-W3.9-P1.27-LS6.0-BL-EP]  19.68 34.37 180 top
U2  LMR14050SDDAR  [SOIC-8_L4.9-W3.9-P1.27-LS6.0-BL-EP]  24.64 11.85 180 top
U3  LMR14050SDDAR  [SOIC-8_L4.9-W3.9-P1.27-LS6.0-BL-EP]  24.38 59.84 180 top
U4  CY62167DV30LL-55ZXIT  [TSOP-48_L18.4-W12.0-P0.50-LS20.0-TL]  102.39 44.62 0 top
U7  74HCT245PW  [TSSOP-20_L6.5-W4.4-P0.65-LS6.4-BL]  277.24 51.43 270 top
U8  U74LVC245G  [TSSOP-20_L6.5-W4.4-P0.65-LS6.4-BL]  277.21 43.65 90 top
U10  TL074IDT  [SOIC-14_L8.7-W3.9-P1.27-LS6.0-BL]  39.95 104.93 0 top
U15  CH334F  [QFN-24_L4.0-W4.0-P0.50-BL-EP2.8]  51.85 50.28 90 top
U16  ESP32-S3FN8  [QFN-56_L7.0-W7.0-P0.40-TL-EP4.0]  216.19 85.03 0 top
U19  ESP32-S3FN8  [QFN-56_L7.0-W7.0-P0.40-TL-EP4.0]  255.5 80.83 0 top
U20  HS96L03W2C03  [OLED-TH_L27.8-W27.2-P2.54_C9900033791]  242.57 45.97 0 top
U23  TPS63700DRCR  [VSON-10_L3.0-W3.0-P0.50-TL-EP]  5.78 24.25 90 top
U24  TPS63700DRCR  [VSON-10_L3.0-W3.0-P0.50-TL-EP]  8.23 8.65 90 top
U27  W25Q128JVSIQ  [SOIC-8_L5.3-W5.3-P1.27-LS8.0-BL]  183.26 87.53 0 top
U28  DS1009-40AT1WX-0A2  [DIP-40_L52.3-W13.9-P2.54-LS15.2-BL-BASE]  147.77 87.76 180 top
U32  FT232HQ-REEL  [QFN-48_L8.0-W8.0-P0.50-BL-EP]  61.18 84.61 90 top
U33  XC7A100T-2CSG324I  [BGA-324_L15.0-W15.0-R18-C18-P0.8-TL]  159.26 46.23 0 top
U34  MAX232DR  [SOIC-16_L9.9-W3.9-P1.27-LS6.0-BL]  153.7 109.72 180 top
U35  MAX232DR  [SOIC-16_L9.9-W3.9-P1.27-LS6.0-BL]  190.78 109.66 180 top
U36  AM26C32IPWR  [TSSOP-16_L5.0-W4.4-P0.65-LS6.4-BL]  129.95 115.64 270 top
U37  MAX232DR  [SOIC-16_L9.9-W3.9-P1.27-LS6.0-BL]  92.21 112.45 180 top
U38  XL74LS04  [SOP-14_L8.6-W3.9-P1.27-LS6.0-BL]  113.29 70.93 180 top
U39  XL74LS157  [SOP-16_L9.9-W3.9-P1.27-LS6.1-BL]  116.28 86.77 270 top
U40  CP2102N-A02-GQFN28R  [QFN-28_L5.0-W5.0-P0.50-TL-EP3.3]  83.84 38.84 0 top
U41  TPS61178RNWR  [VQFN-HR-13_L3.0-W3.5-P0.50-BL]  31.11 83.18 0 top
U42  U74LVC245G  [TSSOP-20_L6.5-W4.4-P0.65-LS6.4-BL]  80.01 21.21 0 top
U43  74HCT245PW  [TSSOP-20_L6.5-W4.4-P0.65-LS6.4-BL]  78.01 126.95 0 top
U44  74HCT245PW  [TSSOP-20_L6.5-W4.4-P0.65-LS6.4-BL]  9.53 68.71 0 top
U45  74HCT245PW  [TSSOP-20_L6.5-W4.4-P0.65-LS6.4-BL]  277.24 74.93 270 top
U46  74HCT245PW  [TSSOP-20_L6.5-W4.4-P0.65-LS6.4-BL]  156.34 73.79 0 top
U47  U74LVC245G  [TSSOP-20_L6.5-W4.4-P0.65-LS6.4-BL]  141.99 67.56 180 top
U48  74HCT245PW  [TSSOP-20_L6.5-W4.4-P0.65-LS6.4-BL]  128.78 72.14 0 top
U49  AT93C56N  [DIP-8_L9.3-W6.4-P2.54-LS7.6-BL]  61.47 64.13 180 top
USB1  TYPE-C 16PIN 2MD(073)  [USB-C-SMD_TYPE-C-6PIN-2MD-073]  4.95 55.75 270 top
USB2  901-211A1021D10100  [USB-A-TH_USB-M-1_C2346]  141.46 11.5 270 top
USB3  901-211A1021D10100  [USB-A-TH_USB-M-1_C2346]  121.51 11.49 270 top
X1  12MHz  [OSC-SMD_4P-L3.2-W2.5-BL]  56.77 49.53 90 top
X3  40MHz  [CRYSTAL-SMD_4P-L2.0-W1.6-BL-A]  218.31 91.82 90 top
X4  40MHz  [CRYSTAL-SMD_4P-L2.0-W1.6-BL-A]  257.56 87.76 90 top
X5  3.6864MHz  [HC-49S_L11.4-W4.8-LS12.7]  142.44 75.14 0 top
X6  125MHz  [OSC-SMD_4P-L7.0-W5.0-BL-2]  147.45 52.58 0 bottom
X7  12MHz  [OSC-SMD_4P-L3.2-W2.5-BL]  66.9 78.14 90 top

## Footprints (pads in the part's own frame, mm; a bottom-side part is the same pattern mirrored in y, then rotated)
AUDIO-TH_PJ-611E
  oval 3x1.6 hole 2.4x1.1: 2(6.4,5.6) 3(6.4,-5.6) 4(0,5.6) 5(0,-5.6) 6(-6.4,5.6) 7(-6.4,-5.6)
BGA-324_L15.0-W15.0-R18-C18-P0.8-TL
  round 0.36 smd: A1(-6.8,6.8) A2(-6,6.8) A3(-5.2,6.8) A4(-4.4,6.8) A5(-3.6,6.8) A6(-2.8,6.8) A7(-2,6.8) A8(-1.2,6.8) A9(-0.4,6.8) A10(0.4,6.8) A11(1.2,6.8) A12(2,6.8) A13(2.8,6.8) A14(3.6,6.8) A15(4.4,6.8) A16(5.2,6.8) A17(6,6.8) A18(6.8,6.8) B1(-6.8,6) B2(-6,6) B3(-5.2,6) B4(-4.4,6) B5(-3.6,6) B6(-2.8,6) B7(-2,6) B8(-1.2,6) B9(-0.4,6) B10(0.4,6) B11(1.2,6) B12(2,6) B13(2.8,6) B14(3.6,6) B15(4.4,6) B16(5.2,6) B17(6,6) B18(6.8,6) C1(-6.8,5.2) C2(-6,5.2) C3(-5.2,5.2) C4(-4.4,5.2) C5(-3.6,5.2) C6(-2.8,5.2) C7(-2,5.2) C8(-1.2,5.2) C9(-0.4,5.2) C10(0.4,5.2) C11(1.2,5.2) C12(2,5.2) C13(2.8,5.2) C14(3.6,5.2) C15(4.4,5.2) C16(5.2,5.2) C17(6,5.2) C18(6.8,5.2) D1(-6.8,4.4) D2(-6,4.4) D3(-5.2,4.4) D4(-4.4,4.4) D5(-3.6,4.4) D6(-2.8,4.4) D7(-2,4.4) D8(-1.2,4.4) D9(-0.4,4.4) D10(0.4,4.4) D11(1.2,4.4) D12(2,4.4) D13(2.8,4.4) D14(3.6,4.4) D15(4.4,4.4) D16(5.2,4.4) D17(6,4.4) D18(6.8,4.4) E1(-6.8,3.6) E2(-6,3.6) E3(-5.2,3.6) E4(-4.4,3.6) E5(-3.6,3.6) E6(-2.8,3.6) E7(-2,3.6) E8(-1.2,3.6) E9(-0.4,3.6) E10(0.4,3.6) E11(1.2,3.6) E12(2,3.6) E13(2.8,3.6) E14(3.6,3.6) E15(4.4,3.6) E16(5.2,3.6) E17(6,3.6) E18(6.8,3.6) F1(-6.8,2.8) F2(-6,2.8) F3(-5.2,2.8) F4(-4.4,2.8) F5(-3.6,2.8) F6(-2.8,2.8) F7(-2,2.8) F8(-1.2,2.8) F9(-0.4,2.8) F10(0.4,2.8) F11(1.2,2.8) F12(2,2.8) F13(2.8,2.8) F14(3.6,2.8) F15(4.4,2.8) F16(5.2,2.8) F17(6,2.8) F18(6.8,2.8) G1(-6.8,2) G2(-6,2) G3(-5.2,2) G4(-4.4,2) G5(-3.6,2) G6(-2.8,2) G7(-2,2) G8(-1.2,2) G9(-0.4,2) G10(0.4,2) G11(1.2,2) G12(2,2) G13(2.8,2) G14(3.6,2) G15(4.4,2) G16(5.2,2) G17(6,2) G18(6.8,2) H1(-6.8,1.2) H2(-6,1.2) H3(-5.2,1.2) H4(-4.4,1.2) H5(-3.6,1.2) H6(-2.8,1.2) H7(-2,1.2) H8(-1.2,1.2) H9(-0.4,1.2) H10(0.4,1.2) H11(1.2,1.2) H12(2,1.2) H13(2.8,1.2) H14(3.6,1.2) H15(4.4,1.2) H16(5.2,1.2) H17(6,1.2) H18(6.8,1.2) J1(-6.8,0.4) J2(-6,0.4) J3(-5.2,0.4) J4(-4.4,0.4) J5(-3.6,0.4) J6(-2.8,0.4) J7(-2,0.4) J8(-1.2,0.4) J9(-0.4,0.4) J10(0.4,0.4) J11(1.2,0.4) J12(2,0.4) J13(2.8,0.4) J14(3.6,0.4) J15(4.4,0.4) J16(5.2,0.4) J17(6,0.4) J18(6.8,0.4) K1(-6.8,-0.4) K2(-6,-0.4) K3(-5.2,-0.4) K4(-4.4,-0.4) K5(-3.6,-0.4) K6(-2.8,-0.4) K7(-2,-0.4) K8(-1.2,-0.4) K9(-0.4,-0.4) K10(0.4,-0.4) K11(1.2,-0.4) K12(2,-0.4) K13(2.8,-0.4) K14(3.6,-0.4) K15(4.4,-0.4) K16(5.2,-0.4) K17(6,-0.4) K18(6.8,-0.4) L1(-6.8,-1.2) L2(-6,-1.2) L3(-5.2,-1.2) L4(-4.4,-1.2) L5(-3.6,-1.2) L6(-2.8,-1.2) L7(-2,-1.2) L8(-1.2,-1.2) L9(-0.4,-1.2) L10(0.4,-1.2) L11(1.2,-1.2) L12(2,-1.2) L13(2.8,-1.2) L14(3.6,-1.2) L15(4.4,-1.2) L16(5.2,-1.2) L17(6,-1.2) L18(6.8,-1.2) M1(-6.8,-2) M2(-6,-2) M3(-5.2,-2) M4(-4.4,-2) M5(-3.6,-2) M6(-2.8,-2) M7(-2,-2) M8(-1.2,-2) M9(-0.4,-2) M10(0.4,-2) M11(1.2,-2) M12(2,-2) M13(2.8,-2) M14(3.6,-2) M15(4.4,-2) M16(5.2,-2) M17(6,-2) M18(6.8,-2) N1(-6.8,-2.8) N2(-6,-2.8) N3(-5.2,-2.8) N4(-4.4,-2.8) N5(-3.6,-2.8) N6(-2.8,-2.8) N7(-2,-2.8) N8(-1.2,-2.8) N9(-0.4,-2.8) N10(0.4,-2.8) N11(1.2,-2.8) N12(2,-2.8) N13(2.8,-2.8) N14(3.6,-2.8) N15(4.4,-2.8) N16(5.2,-2.8) N17(6,-2.8) N18(6.8,-2.8) P1(-6.8,-3.6) P2(-6,-3.6) P3(-5.2,-3.6) P4(-4.4,-3.6) P5(-3.6,-3.6) P6(-2.8,-3.6) P7(-2,-3.6) P8(-1.2,-3.6) P9(-0.4,-3.6) P10(0.4,-3.6) P11(1.2,-3.6) P12(2,-3.6) P13(2.8,-3.6) P14(3.6,-3.6) P15(4.4,-3.6) P16(5.2,-3.6) P17(6,-3.6) P18(6.8,-3.6) R1(-6.8,-4.4) R2(-6,-4.4) R3(-5.2,-4.4) R4(-4.4,-4.4) R5(-3.6,-4.4) R6(-2.8,-4.4) R7(-2,-4.4) R8(-1.2,-4.4) R9(-0.4,-4.4) R10(0.4,-4.4) R11(1.2,-4.4) R12(2,-4.4) R13(2.8,-4.4) R14(3.6,-4.4) R15(4.4,-4.4) R16(5.2,-4.4) R17(6,-4.4) R18(6.8,-4.4) T1(-6.8,-5.2) T2(-6,-5.2) T3(-5.2,-5.2) T4(-4.4,-5.2) T5(-3.6,-5.2) T6(-2.8,-5.2) T7(-2,-5.2) T8(-1.2,-5.2) T9(-0.4,-5.2) T10(0.4,-5.2) T11(1.2,-5.2) T12(2,-5.2) T13(2.8,-5.2) T14(3.6,-5.2) T15(4.4,-5.2) T16(5.2,-5.2) T17(6,-5.2) T18(6.8,-5.2) U1(-6.8,-6) U2(-6,-6) U3(-5.2,-6) U4(-4.4,-6) U5(-3.6,-6) U6(-2.8,-6) U7(-2,-6) U8(-1.2,-6) U9(-0.4,-6) U10(0.4,-6) U11(1.2,-6) U12(2,-6) U13(2.8,-6) U14(3.6,-6) U15(4.4,-6) U16(5.2,-6) U17(6,-6) U18(6.8,-6) V1(-6.8,-6.8) V2(-6,-6.8) V3(-5.2,-6.8) V4(-4.4,-6.8) V5(-3.6,-6.8) V6(-2.8,-6.8) V7(-2,-6.8) V8(-1.2,-6.8) V9(-0.4,-6.8) V10(0.4,-6.8) V11(1.2,-6.8) V12(2,-6.8) V13(2.8,-6.8) V14(3.6,-6.8) V15(4.4,-6.8) V16(5.2,-6.8) V17(6,-6.8) V18(6.8,-6.8)
BUZ-TH_BD23.0-P10.0-D0.0.8-FD
  round 2 hole 1.2: 1(-5,0) 2(5,0)
C0201
  rect 0.368x0.324 smd: 1(-0.275,0) 2(0.275,0)
C0402
  rect 0.566x0.54 smd: 1(-0.426,0) 2(0.439,0)
C0402#3
  rect 0.5x0.54 smd: 1(-0.42,0) 2(0.42,0)
C0402#2
  rect 0.79x0.54 smd: 1(-0.545,0) 2(0.545,0)
C0603
  rect 0.8x0.9 smd: 1(-0.7,0) 2(0.7,0)
C0805
  rect 1.41x1.35 smd: 1(-1,0) 2(1,0)
C1206
  rect 1.485x1.728 smd: 1(-1.593,0) 2(1.593,0)
C1210
  rect 1.635x2.7 smd: 1(-1.518,0) 2(1.518,0)
CONN-TH_20P-P2.54_XKB_X9555WR-2X10-6TV01
  rect 1.6x1.6 hole 1.1: 1(11.43,1.27)
  round 1.6 hole 1.1: 2(11.43,-1.27) 3(8.89,1.27) 4(8.89,-1.27) 5(6.35,1.27) 6(6.35,-1.27) 7(3.81,1.27) 8(3.81,-1.27) 9(1.27,1.27) 10(1.27,-1.27) 11(-1.27,1.27) 12(-1.27,-1.27) 13(-3.81,1.27) 14(-3.81,-1.27) 15(-6.35,1.27) 16(-6.35,-1.27) 17(-8.89,1.27) 18(-8.89,-1.27) 19(-11.43,1.27) 20(-11.43,-1.27)
CRYSTAL-SMD_4P-L2.0-W1.6-BL-A
  rect 0.875x0.775 smd: 1(-0.638,-0.488) 2(0.638,-0.488) 3(0.638,0.488) 4(-0.638,0.488)
DB9-TH_D-SUB-DR-9PCM-CB
  rect 1.8x1.8 hole 1.1: 1(5.54,1.42)
  round 1.8 hole 1.1: 2(2.77,1.42) 3(0,1.42) 4(-2.77,1.42) 5(-5.54,1.42) 6(4.155,-1.42) 7(1.385,-1.42) 8(-1.385,-1.42) 9(-4.155,-1.42)
  round 4.5 hole 3.2: 10(-12.5,0) 11(12.5,0)
DB25-TH_D-SUB-DR-25PCM-BB
  rect 1.8x1.8 hole 1.1: 1(16.62,1.42)
  round 1.8 hole 1.1: 2(13.85,1.42) 3(11.08,1.42) 4(8.31,1.42) 5(5.54,1.42) 6(2.77,1.42) 7(0,1.42) 8(-2.77,1.42) 9(-5.54,1.42) 10(-8.31,1.42) 11(-11.08,1.42) 12(-13.85,1.42) 13(-16.62,1.42) 14(15.235,-1.42) 15(12.465,-1.42) 16(9.695,-1.42) 17(6.925,-1.42) 18(4.155,-1.42) 19(1.385,-1.42) 20(-1.385,-1.42) 21(-4.155,-1.42) 22(-6.925,-1.42) 23(-9.695,-1.42) 24(-12.465,-1.42) 25(-15.235,-1.42)
  round 5 hole 3.2: 26(23.52,0) 27(-23.52,0)
DIP-8_L9.3-W6.4-P2.54-LS7.6-BL
  rect 1.8x1.8 hole 1: 1(-3.81,-3.81)
  round 1.8 hole 1: 2(-1.27,-3.81) 3(1.27,-3.81) 4(3.81,-3.81) 5(3.81,3.81) 6(1.27,3.81) 7(-1.27,3.81) 8(-3.81,3.81)
DIP-40_L52.3-W13.9-P2.54-LS15.2-BL-BASE
  rect 1.8x1.8 hole 1: 1(-24.13,-7.62)
  round 1.8 hole 1: 2(-21.59,-7.62) 3(-19.05,-7.62) 4(-16.51,-7.62) 5(-13.97,-7.62) 6(-11.43,-7.62) 7(-8.89,-7.62) 8(-6.35,-7.62) 9(-3.81,-7.62) 10(-1.27,-7.62) 11(1.27,-7.62) 12(3.81,-7.62) 13(6.35,-7.62) 14(8.89,-7.62) 15(11.43,-7.62) 16(13.97,-7.62) 17(16.51,-7.62) 18(19.05,-7.62) 19(21.59,-7.62) 20(24.13,-7.62) 21(24.13,7.62) 22(21.59,7.62) 23(19.05,7.62) 24(16.51,7.62) 25(13.97,7.62) 26(11.43,7.62) 27(8.89,7.62) 28(6.35,7.62) 29(3.81,7.62) 30(1.27,7.62) 31(-1.27,7.62) 32(-3.81,7.62) 33(-6.35,7.62) 34(-8.89,7.62) 35(-11.43,7.62) 36(-13.97,7.62) 37(-16.51,7.62) 38(-19.05,7.62) 39(-21.59,7.62) 40(-24.13,7.62)
HC-49S_L11.4-W4.8-LS12.7
  rect 5.5x1.3 smd: 1(-4.553,0) 2(4.553,0)
HDMI-SMD_HDMI-001S
  rect 0.3x2.6 smd: 1(4.5,3.36) 2(4,3.36) 3(3.5,3.36) 4(3,3.36) 5(2.5,3.36) 6(2,3.36) 7(1.5,3.36) 8(1,3.36) 9(0.5,3.36) 10(0,3.36) 11(-0.5,3.36) 12(-1,3.36) 13(-1.5,3.36) 14(-2,3.36) 15(-2.5,3.36) 16(-3,3.36) 17(-3.5,3.36) 18(-4,3.36) 19(-4.5,3.36)
  oval 1.5x3.5 hole 1x2.8: 20(-7.25,2.6) 21(7.25,2.6)
  oval 1.5x2.3 hole 1x1.7: 22(-7.25,-3.36) 23(7.25,-3.36)
HDR-TH_2P-P2.54-V-M-3
  rect 1.8x1.8 hole 1.1: 1(-1.27,0)
  round 1.8 hole 1.1: 2(1.27,0)
HDR-TH_3P-P2.54-V-M-1
  rect 1.575x1.8 hole 1.2: 1(-2.54,0)
  round 1.8 hole 1.2: 2(0,0) 3(2.54,0)
HDR-TH_4P-P2.54-H-M-R2-C2-S2.54
  rect 1.778x1.8 hole 1.1: 1(-1.27,-1.27)
  round 1.8 hole 1.1: 2(-1.27,1.27) 3(1.27,-1.27) 4(1.27,1.27)
HDR-TH_6P-P2.54-V-M
  rect 1.7x1.7 hole 1.1: 1(-6.35,0)
  round 1.7 hole 1.1: 2(-3.81,0) 3(-1.27,0) 4(1.27,0) 5(3.81,0) 6(6.35,0)
HDR-TH_6P-P2.54-V-M-R2-C3-S2.54-1
  rect 1.8x1.8 hole 1.05: 1(-2.54,-1.27)
  round 1.8 hole 1.05: 2(-2.54,1.27) 3(0,-1.27) 4(0,1.27) 5(2.54,-1.27) 6(2.54,1.27)
HDR-TH_8P-P2.54-V-F-R2-C4-S2.54
  rect 1.6x1.6 hole 1.1: 1(-3.81,-1.27)
  round 1.6 hole 1.1: 2(-3.81,1.27) 3(-1.27,-1.27) 4(-1.27,1.27) 5(1.27,-1.27) 6(1.27,1.27) 7(3.81,-1.27) 8(3.81,1.27)
HDR-TH_15P-P2.54-V-M
  rect 1.6x1.6 hole 1.05: 1(-17.78,0)
  round 1.6 hole 1.05: 2(-15.24,0) 3(-12.7,0) 4(-10.16,0) 5(-7.62,0) 6(-5.08,0) 7(-2.54,0) 8(0,0) 9(2.54,0) 10(5.08,0) 11(7.62,0) 12(10.16,0) 13(12.7,0) 14(15.24,0) 15(17.78,0)
IND-SMD_L1.6-W0.8
  rect 0.762x1 smd: 1(-0.724,0) 2(0.724,0)
IND-SMD_L4.0-W4.0_FNR40XXS
  rect 1.6x3.9 smd: 1(-1.5,0) 2(1.5,0)
IND-SMD_L4.5-W4.2
  rect 1.675x1.95 smd: 1(-1.8,0) 2(1.8,0)
IND-SMD_L7.0-W6.6
  rect 2.4x3.2 smd: 1(-3,0) 2(3,0)
IND-SMD_L11.5-W10.0_FXL1040
  rect 3x3.5 smd: 1(-5,0) 2(5,0)
KEY-SMD_4P-L6.0-W6.0-P4.50-LS9.0
  rect 1.9x1.3 smd: 1(-4.2,2.25) 2(4.2,2.25) 3(-4.2,-2.25) 4(4.2,-2.25)
KEY-SMD_B3U-1000PM
  rect 0.8x1.7 smd: 1(-1.7,0) 2(1.7,0)
L0402-RD
  rect 0.79x0.54 smd: 1(-0.545,0) 2(0.545,0)
LED0603-RD_GREEN
  rect 0.8x0.8 smd: 1(-0.799,-0.004) 2(0.799,0.004)
LED0603-RD_RED
  rect 0.8x0.8 smd: 1(-0.799,-0.004) 2(0.799,0.004)
LED-ARRAY-SMD_4P-L1.6-W1.5-BL-FD
  rect 1.1x0.6 smd: 1(-0.95,-0.45) 2(0.95,-0.45) 3(0.95,0.45) 4(-0.95,0.45)
OLED-TH_L27.8-W27.2-P2.54_C9900033791
  round 1.8 hole 1.05: 1(-3.81,0) 2(-1.27,0) 3(1.27,0) 4(3.81,0)
OSC-SMD_4P-L3.2-W2.5-BL
  rect 1.4x1.2 smd: 1(-1.1,-0.875) 2(1.1,-0.875) 3(1.1,0.875) 4(-1.1,0.875)
OSC-SMD_4P-L7.0-W5.0-BL-2
  rect 1.8x2 smd: 1(-2.54,-2.1) 2(2.54,-2.1) 3(2.54,2.1) 4(-2.54,2.1)
QFN-24_L4.0-W4.0-P0.50-BL-EP2.8
  oval 0.28x0.7 smd: 1(-1.25,-2) 2(-0.75,-2) 3(-0.25,-2) 4(0.25,-2) 5(0.75,-2) 6(1.25,-2) 13(1.25,2) 14(0.75,2) 15(0.25,2) 16(-0.25,2) 17(-0.75,2) 18(-1.25,2)
  oval 0.7x0.28 smd: 7(2,-1.25) 8(2,-0.75) 9(2,-0.25) 10(2,0.25) 11(2,0.75) 12(2,1.25) 19(-2,1.25) 20(-2,0.75) 21(-2,0.25) 22(-2,-0.25) 23(-2,-0.75) 24(-2,-1.25)
  rect 2.8x2.8 smd: 25(0.013,0)
QFN-28_L5.0-W5.0-P0.50-TL-EP3.3
  rect 0.905x0.28 smd: 1(-2.377,1.5) 2(-2.377,1) 3(-2.377,0.5) 4(-2.377,0) 5(-2.377,-0.5) 6(-2.377,-1) 7(-2.377,-1.5) 15(2.377,-1.5) 16(2.377,-1) 17(2.377,-0.5) 18(2.377,0) 19(2.377,0.5) 20(2.377,1) 21(2.377,1.5)
  rect 0.28x0.905 smd: 8(-1.5,-2.377) 9(-1,-2.377) 10(-0.5,-2.377) 11(0,-2.377) 12(0.5,-2.377) 13(1,-2.377) 14(1.5,-2.377) 22(1.5,2.377) 23(1,2.377) 24(0.5,2.377) 25(0,2.377) 26(-0.5,2.377) 27(-1,2.377) 28(-1.5,2.377)
  rect 3.35x3.35 smd: 29(0,0)
QFN-48_L8.0-W8.0-P0.50-BL-EP
  rect 0.28x0.905 smd: 1(-2.75,-3.877) 2(-2.25,-3.877) 3(-1.75,-3.877) 4(-1.25,-3.877) 5(-0.75,-3.877) 6(-0.25,-3.877) 7(0.25,-3.877) 8(0.75,-3.877) 9(1.25,-3.877) 10(1.75,-3.877) 11(2.25,-3.877) 12(2.75,-3.877) 25(2.75,3.877) 26(2.25,3.877) 27(1.75,3.877) 28(1.25,3.877) 29(0.75,3.877) 30(0.25,3.877) 31(-0.25,3.877) 32(-0.75,3.877) 33(-1.25,3.877) 34(-1.75,3.877) 35(-2.25,3.877) 36(-2.75,3.877)
  rect 0.905x0.28 smd: 13(3.877,-2.75) 14(3.877,-2.25) 15(3.877,-1.75) 16(3.877,-1.25) 17(3.877,-0.75) 18(3.877,-0.25) 19(3.877,0.25) 20(3.877,0.75) 21(3.877,1.25) 22(3.877,1.75) 23(3.877,2.25) 24(3.877,2.75) 37(-3.877,2.75) 38(-3.877,2.25) 39(-3.877,1.75) 40(-3.877,1.25) 41(-3.877,0.75) 42(-3.877,0.25) 43(-3.877,-0.25) 44(-3.877,-0.75) 45(-3.877,-1.25) 46(-3.877,-1.75) 47(-3.877,-2.25) 48(-3.877,-2.75)
  rect 6.2x6.2 smd: 49(0,0)
QFN-56_L7.0-W7.0-P0.40-TL-EP4.0
  rect 0.665x0.2 smd: 1(-3.408,2.6) 2(-3.408,2.2) 3(-3.408,1.8) 4(-3.408,1.4) 5(-3.408,1) 6(-3.408,0.6) 7(-3.408,0.2) 8(-3.408,-0.2) 9(-3.408,-0.6) 10(-3.408,-1) 11(-3.408,-1.4) 12(-3.408,-1.8) 13(-3.408,-2.2) 14(-3.408,-2.6) 29(3.408,-2.6) 30(3.408,-2.2) 31(3.408,-1.8) 32(3.408,-1.4) 33(3.408,-1) 34(3.408,-0.6) 35(3.408,-0.2) 36(3.408,0.2) 37(3.408,0.6) 38(3.408,1) 39(3.408,1.4) 40(3.408,1.8) 41(3.408,2.2) 42(3.408,2.6)
  rect 0.2x0.665 smd: 15(-2.6,-3.408) 16(-2.2,-3.408) 17(-1.8,-3.408) 18(-1.4,-3.408) 19(-1,-3.408) 20(-0.6,-3.408) 21(-0.2,-3.408) 22(0.2,-3.408) 23(0.6,-3.408) 24(1,-3.408) 25(1.4,-3.408) 26(1.8,-3.408) 27(2.2,-3.408) 28(2.6,-3.408) 43(2.6,3.408) 44(2.2,3.408) 45(1.8,3.408) 46(1.4,3.408) 47(1,3.408) 48(0.6,3.408) 49(0.2,3.408) 50(-0.2,3.408) 51(-0.6,3.408) 52(-1,3.408) 53(-1.4,3.408) 54(-1.8,3.408) 55(-2.2,3.408) 56(-2.6,3.408)
  rect 4x4 smd: 57(0,0)
R0402
  rect 0.566x0.54 smd: 1(-0.433,0) 2(0.433,0)
R0603
  rect 0.806x0.864 smd: 1(-0.753,0) 2(0.753,0)
RES-ADJ-SMD_3P-L3.0-W3.8-P1.75-BR
  rect 1.2x1.2 smd: 1(1.625,-1) 3(1.625,1)
  rect 1.5x1.6 smd: 2(-1.625,0)
RES-ARRAY-SMD_0603-8P-L3.2-W1.6-BL
  rect 0.65x0.8 smd: 1(-1.2,-0.9) 4(1.2,-0.9) 5(1.2,0.9) 8(-1.2,0.9)
  rect 0.5x0.8 smd: 2(-0.4,-0.9) 3(0.4,-0.9) 6(0.4,0.9) 7(-0.4,0.9)
SMA_L4.3-W2.6-LS5.0-RD
  rect 2.046x1.62 smd: 1(-2.404,-0.009) 2(2.404,0.009)
SMF_L2.8-W1.8-LS3.7-RD
  rect 1.2x1.2 smd: 1(-1.685,0) 2(1.685,0)
SOD-123_L2.7-W1.8-LS3.7-RD
  rect 1x1.1 smd: 1(-1.627,0) 2(1.627,0)
SOIC-8_L4.9-W3.9-P1.27-LS6.0-BL-EP
  oval 0.602x1.941 smd: 1(-1.905,-2.72) 2(-0.635,-2.72) 3(0.635,-2.72) 4(1.905,-2.72) 5(1.905,2.72) 6(0.635,2.72) 7(-0.635,2.72) 8(-1.905,2.72)
  rect 3.098x2.41 smd: 9(0,0)
SOIC-8_L5.3-W5.3-P1.27-LS8.0-BL
  oval 0.63x2.25 smd: 1(-1.905,-3.53) 2(-0.635,-3.53) 3(0.635,-3.53) 4(1.905,-3.53) 5(1.905,3.53) 6(0.635,3.53) 7(-0.635,3.53) 8(-1.905,3.53)
SOIC-14_L8.7-W3.9-P1.27-LS6.0-BL
  oval 0.574x2.038 smd: 1(-3.81,-2.769) 2(-2.54,-2.769) 3(-1.27,-2.769) 4(0,-2.769) 5(1.27,-2.769) 6(2.54,-2.769) 7(3.81,-2.769) 8(3.81,2.769) 9(2.54,2.769) 10(1.27,2.769) 11(0,2.769) 12(-1.27,2.769) 13(-2.54,2.769) 14(-3.81,2.769)
SOIC-16_L9.9-W3.9-P1.27-LS6.0-BL
  oval 0.602x1.971 smd: 1(-4.445,-2.736) 2(-3.175,-2.736) 3(-1.905,-2.736) 4(-0.635,-2.736) 5(0.635,-2.736) 6(1.905,-2.736) 7(3.175,-2.736) 8(4.445,-2.736) 9(4.445,2.736) 10(3.175,2.736) 11(1.905,2.736) 12(0.635,2.736) 13(-0.635,2.736) 14(-1.905,2.736) 15(-3.175,2.736) 16(-4.445,2.736)
SOP-14_L8.6-W3.9-P1.27-LS6.0-BL
  oval 0.595x1.968 smd: 1(-3.81,-2.734) 2(-2.54,-2.734) 3(-1.27,-2.734) 4(0,-2.734) 5(1.27,-2.734) 6(2.54,-2.734) 7(3.81,-2.734) 8(3.81,2.734) 9(2.54,2.734) 10(1.27,2.734) 11(0,2.734) 12(-1.27,2.734) 13(-2.54,2.734) 14(-3.81,2.734)
SOP-16_L9.9-W3.9-P1.27-LS6.1-BL
  oval 0.6x1.6 smd: 1(-4.445,-2.6) 2(-3.175,-2.6) 3(-1.905,-2.6) 4(-0.635,-2.6) 5(0.635,-2.6) 6(1.905,-2.6) 7(3.175,-2.6) 8(4.445,-2.6) 9(4.445,2.6) 10(3.175,2.6) 11(1.905,2.6) 12(0.635,2.6) 13(-0.635,2.6) 14(-1.905,2.6) 15(-3.175,2.6) 16(-4.445,2.6)
SOT-23-3_L2.9-W1.3-P1.90-LS2.4-BR
  rect 1.25x0.7 smd: 1(1,-0.95) 2(1,0.95) 3(-1,0)
SOT-23-3_L2.9-W1.3-P1.90-LS2.4-TR
  rect 1.25x0.7 smd: 1(1.25,0.95) 2(1.25,-0.95) 3(-1.25,0)
SOT-23-3_L2.9-W1.6-P1.90-LS2.8-BR
  rect 1.07x0.6 smd: 1(1.235,-0.95) 2(1.235,0.95) 3(-1.235,0)
SOT-23-6_L2.9-W1.6-P0.95-LS2.8-BL
  rect 0.532x1.072 smd: 1(-0.95,-1.149) 2(0,-1.149) 3(0.95,-1.149) 4(0.95,1.149) 5(0,1.149) 6(-0.95,1.149)
SOT-89-3_L4.5-W2.5-P1.50-LS4.2-TR
  oval 0.7x1.9 smd: 1(1.501,0.82) 3(-1.501,0.82)
  custom 2.032x5.055 smd: 2(-0.001,-0.82)
SW-TH_SS-12D10L3
  round 2.5 hole 1.7: 1(-4.7,0) 2(0,0) 3(4.7,0)
TF-SMD_TF-01A
  rect 0.6x1.3 smd: 1(2.24,5.276) 2(1.14,5.276) 3(0.04,5.276) 4(-1.06,5.276) 5(-2.16,5.276) 6(-3.26,5.276) 7(-4.36,5.276) 8(-5.46,5.276) 9(-6.56,5.276)
  rect 1.2x1.4 smd: 10(-7.76,4.426) 13(6.92,4.426)
  rect 1.2x2 smd: 11(-7.76,-5.276) 12(7.76,-5.276)
TO-277A_L6.1-W4.6-P2.13-LS6.5-TR
  rect 1.6x1.4 smd: 1(2,1.065) 2(2,-1.065)
  rect 5.05x4.8 smd: 3(-2,0)
TSOP-48_L18.4-W12.0-P0.50-LS20.0-TL
  oval 1.47x0.28 smd: 1(-9.68,5.75) 2(-9.68,5.25) 3(-9.68,4.75) 4(-9.68,4.25) 5(-9.68,3.75) 6(-9.68,3.25) 7(-9.68,2.75) 8(-9.68,2.25) 9(-9.68,1.75) 10(-9.68,1.25) 11(-9.68,0.75) 12(-9.68,0.25) 13(-9.68,-0.25) 14(-9.68,-0.75) 15(-9.68,-1.25) 16(-9.68,-1.75) 17(-9.68,-2.25) 18(-9.68,-2.75) 19(-9.68,-3.25) 20(-9.68,-3.75) 21(-9.68,-4.25) 22(-9.68,-4.75) 23(-9.68,-5.25) 24(-9.68,-5.75) 25(9.68,-5.75) 26(9.68,-5.25) 27(9.68,-4.75) 28(9.68,-4.25) 29(9.68,-3.75) 30(9.68,-3.25) 31(9.68,-2.75) 32(9.68,-2.25) 33(9.68,-1.75) 34(9.68,-1.25) 35(9.68,-0.75) 36(9.68,-0.25) 37(9.68,0.25) 38(9.68,0.75) 39(9.68,1.25) 40(9.68,1.75) 41(9.68,2.25) 42(9.68,2.75) 43(9.68,3.25) 44(9.68,3.75) 45(9.68,4.25) 46(9.68,4.75) 47(9.68,5.25) 48(9.68,5.75)
TSSOP-16_L5.0-W4.4-P0.65-LS6.4-BL
  oval 0.343x1.732 smd: 1(-2.275,-2.866) 2(-1.625,-2.866) 3(-0.975,-2.866) 4(-0.325,-2.866) 5(0.325,-2.866) 6(0.975,-2.866) 7(1.625,-2.866) 8(2.275,-2.866) 9(2.275,2.866) 10(1.625,2.866) 11(0.975,2.866) 12(0.325,2.866) 13(-0.325,2.866) 14(-0.975,2.866) 15(-1.625,2.866) 16(-2.275,2.866)
TSSOP-20_L6.5-W4.4-P0.65-LS6.4-BL
  oval 0.364x1.742 smd: 1(-2.925,-2.871) 2(-2.275,-2.871) 3(-1.625,-2.871) 4(-0.975,-2.871) 5(-0.325,-2.871) 6(0.325,-2.871) 7(0.975,-2.871) 8(1.625,-2.871) 9(2.275,-2.871) 10(2.925,-2.871) 11(2.925,2.871) 12(2.275,2.871) 13(1.625,2.871) 14(0.975,2.871) 15(0.325,2.871) 16(-0.325,2.871) 17(-0.975,2.871) 18(-1.625,2.871) 19(-2.275,2.871) 20(-2.925,2.871)
USB-A-TH_USB-M-1_C2346
  round 3.2 hole 2.3: 0(1.385,7) 0(1.385,-7)
  round 1.7 hole 1.1: 1(-1.385,-3.521) 2(-1.385,-1.018) 3(-1.385,0.981) 4(-1.385,3.48)
USB-C-SMD_TYPE-C-6PIN-2MD-073
  rect 0.55x1.1 smd: 1(-3.2,2.375) 2(-2.4,2.375) 11(2.4,2.375) 12(3.2,2.375)
  rect 0.3x1.1 smd: 3(-1.75,2.375) 4(-1.25,2.375) 5(-0.75,2.375) 6(-0.25,2.375) 7(0.25,2.375) 8(0.75,2.375) 9(1.25,2.375) 10(1.75,2.375)
  oval 1.1x2 hole 0.6x1.5: 13(-4.325,1.825) 14(4.325,1.825)
  oval 1.2x1.8 hole 0.6x1.2: 13(-4.325,-2.375) 14(4.325,-2.375)
VQFN-HR-13_L3.0-W3.5-P0.50-BL
  rect 0.25x0.7 smd: 1(-1,-1.6) 2(-0.5,-1.6) 3(0,-1.6) 4(0.5,-1.6) 5(1,-1.6) 9(1,1.6) 10(0.5,1.6) 11(0,1.6) 12(-0.5,1.6) 13(-1,1.6)
  rect 3.4x0.25 smd: 6(0,-0.55) 7(0,0) 8(0,0.55)
VSON-10_L3.0-W3.0-P0.50-TL-EP
  rect 0.8x0.3 smd: 1(-1.5,1) 2(-1.5,0.5) 3(-1.5,0) 4(-1.5,-0.5) 5(-1.5,-1) 6(1.5,-1) 7(1.5,-0.5) 8(1.5,0) 9(1.5,0.5) 10(1.5,1)
  custom 1.52x3.42 smd: 11(0.002,-0.009)
